# Altium schematic sheet 3Phase Inverter1.SchDoc
size A2
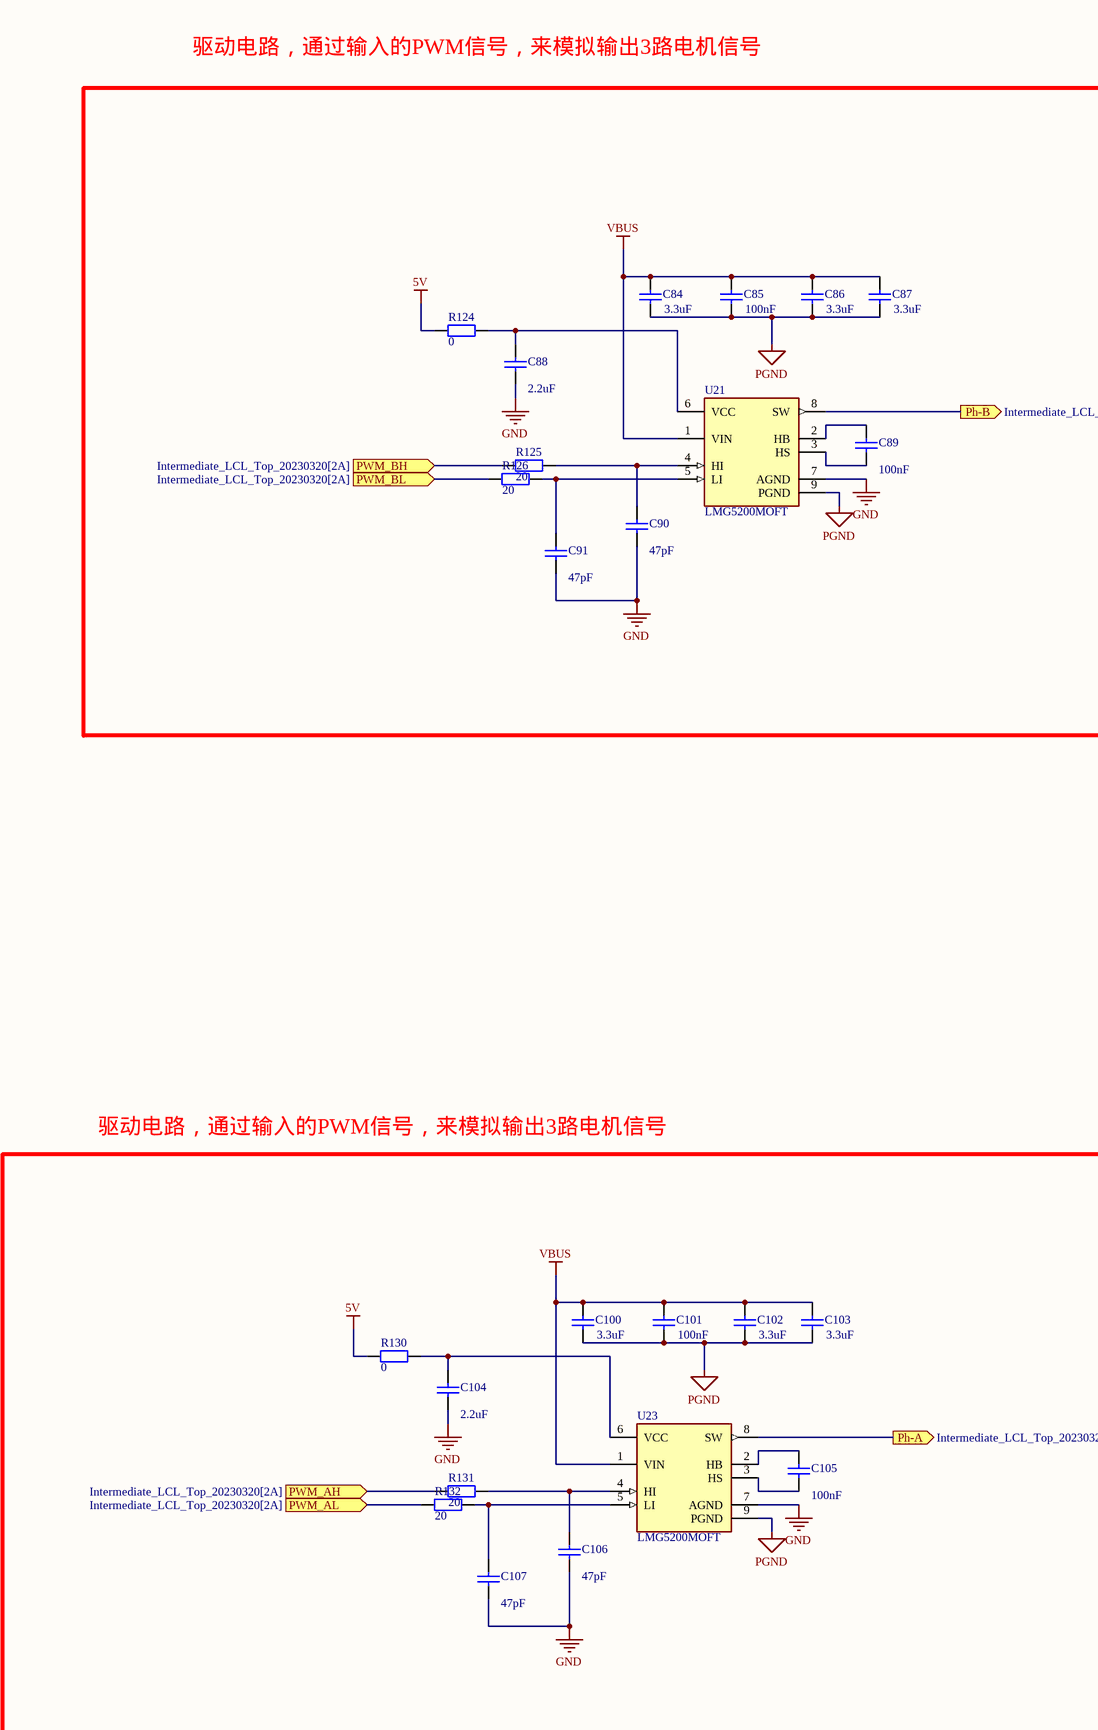
[diagram p0: 3Phase Inverter1.SchDoc, left]
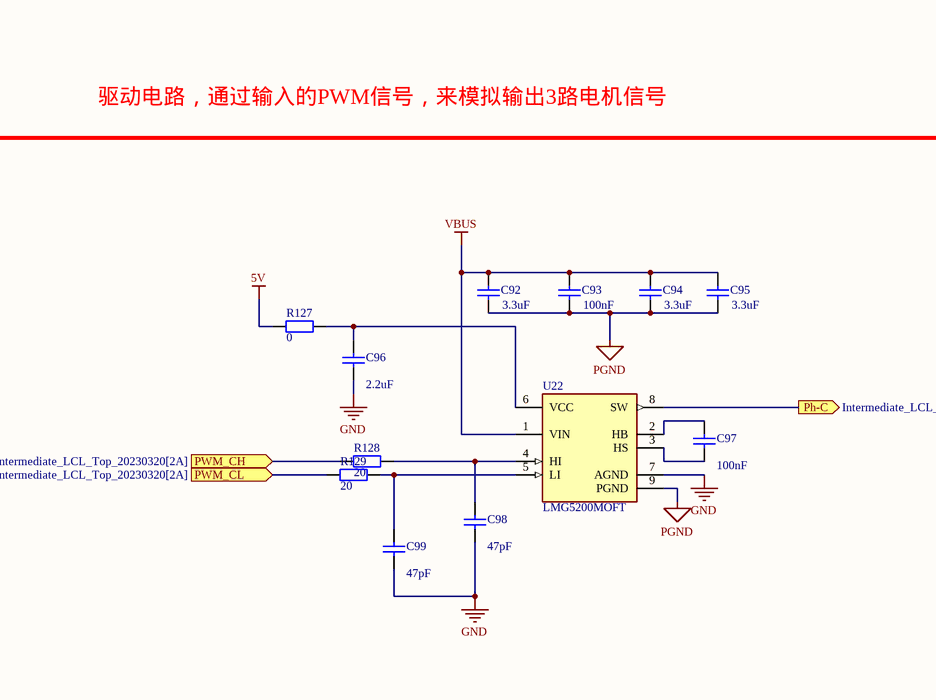
[diagram p1: 3Phase Inverter1.SchDoc, right]

## Parts
C84  3.3uF  [CAPC1608X06N]
C85  100nF  [CAPC1608X06N]
C86  3.3uF  [CAPC1608X06N]
C87  3.3uF  [CAPC1608X06N]
C88  2.2uF  [CAPC1608X06N]
C89  100nF  [CAPC1608X06N]
C90  47pF  [CAPC1608X06N]
C91  47pF  [CAPC1608X06N]
C92  3.3uF  [CAPC1608X06N]
C93  100nF  [CAPC1608X06N]
C94  3.3uF  [CAPC1608X06N]
C95  3.3uF  [CAPC1608X06N]
C96  2.2uF  [CAPC1608X06N]
C97  100nF  [CAPC1608X06N]
C98  47pF  [CAPC1608X06N]
C99  47pF  [CAPC1608X06N]
C100  3.3uF  [CAPC1608X06N]
C101  100nF  [CAPC1608X06N]
C102  3.3uF  [CAPC1608X06N]
C103  3.3uF  [CAPC1608X06N]
C104  2.2uF  [CAPC1608X06N]
C105  100nF  [CAPC1608X06N]
C106  47pF  [CAPC1608X06N]
C107  47pF  [CAPC1608X06N]
R124  0  [RESC1608X05N]
R125  20  [RESC1608X05N]
R126  20  [RESC1608X05N]
R127  0  [RESC1608X05N]
R128  20  [RESC1608X05N]
R129  20  [RESC1608X05N]
R130  0  [RESC1608X05N]
R131  20  [RESC1608X05N]
R132  20  [RESC1608X05N]
U21  LMG5200MOFT  [FP-MOF0009A-MFG]
U22  LMG5200MOFT  [FP-MOF0009A-MFG]
U23  LMG5200MOFT  [FP-MOF0009A-MFG]

## Ports
Ph-A (out, see Intermediate_LCL_Top_20230320[3A], 3Phase Inverter2[1A]), Ph-B (out, see Intermediate_LCL_Top_20230320[3A], 3Phase Inverter2[5B]), Ph-C (out, see Intermediate_LCL_Top_20230320[3A], 3Phase Inverter2[1C]), PWM_AH (in, see Intermediate_LCL_Top_20230320[2A]), PWM_AL (in, see Intermediate_LCL_Top_20230320[2A]), PWM_BH (in, see Intermediate_LCL_Top_20230320[2A]), PWM_BL (in, see Intermediate_LCL_Top_20230320[2A]), PWM_CH (in, see Intermediate_LCL_Top_20230320[2A]), PWM_CL (in, see Intermediate_LCL_Top_20230320[2A])

## Nets
5V: R124.2 R127.2 R130.2
GND: C88.1 C90.2 C91.2 C96.1 C98.2 C99.2 C104.1 C106.2 C107.2 U21.7(AGND) U22.7(AGND) U23.7(AGND)
PGND: C84.1 C85.2 C86.1 C87.1 C92.1 C93.2 C94.1 C95.1 C100.1 C101.2 C102.1 C103.1 U21.9(PGND) U22.9(PGND) U23.9(PGND)
VBUS: C84.2 C85.1 C86.2 C87.2 C92.2 C93.1 C94.2 C95.2 C100.2 C101.1 C102.2 C103.2 U21.1(VIN) U22.1(VIN) U23.1(VIN)
Ph-A: U23.8(SW) ; port Ph-A
Ph-B: U21.8(SW) ; port Ph-B
Ph-C: U22.8(SW) ; port Ph-C
PWM_AH: R131.2 ; port PWM_AH
PWM_AL: R132.2 ; port PWM_AL
PWM_BH: R125.2 ; port PWM_BH
PWM_BL: R126.2 ; port PWM_BL
PWM_CH: R128.2 ; port PWM_CH
PWM_CL: R129.2 ; port PWM_CL
NetC88_2: C88.2 R124.1 U21.6(VCC)
NetC89_1: C89.1 U21.2(HB)
NetC89_2: C89.2 U21.3(HS)
NetC90_1: C90.1 R125.1 U21.4(HI)
NetC91_1: C91.1 R126.1 U21.5(LI)
NetC96_2: C96.2 R127.1 U22.6(VCC)
NetC97_1: C97.1 U22.2(HB)
NetC97_2: C97.2 U22.3(HS)
NetC98_1: C98.1 R128.1 U22.4(HI)
NetC99_1: C99.1 R129.1 U22.5(LI)
NetC104_2: C104.2 R130.1 U23.6(VCC)
NetC105_1: C105.1 U23.2(HB)
NetC105_2: C105.2 U23.3(HS)
NetC106_1: C106.1 R131.1 U23.4(HI)
NetC107_1: C107.1 R132.1 U23.5(LI)

## Notes on the sheet
- 驱动电路，通过输入的PWM信号，来模拟输出3路电机信号

## Library data of the parts
C84-C107 = Cap: Capacitor; Published: 8-Jun-2000; LatestRevisionDate: 17-Jul-2002; LatestRevisionNote: Re-released for DXP Platform.; PackageReference: RAD-0.3; Publisher: Altium Limited; PackageDescription: Radial Cap, Thru-Hole; 2 Leads; 0.3 in Pin Spacing
  C84 C86 C87 C92 C94 C95 C100 C102 C103: Value: 3.3uF
  C85 C89 C93 C97 C101 C105: Value: 100nF
  C88 C96 C104: Value: 2.2uF
  C90 C91 C98 C99 C106 C107: Value: 47pF
R124-R132 = 0603 100KΩ (1003) 1%_4: 贴片电阻; Value: 1MΩ(1%); ComponentLink1Description: 供应商链接; ComponentLink1URL: http://www.szlcsc.com/product/details_26546.html; Package: 0603; Supplier: LC; SuppliersPartNumber: C25803
U21-U23 = CMP-04912-000022-2: None; Output Current per Channel: 10A; Interface: Logic; Min Operating Temperature: -40°C; Mount: Surface Mount; Case/Package: QFN; RoHS Compliant: Yes; Packaging: Cut Tape; Max Operating Temperature: 125°C; Number of Pins: 9